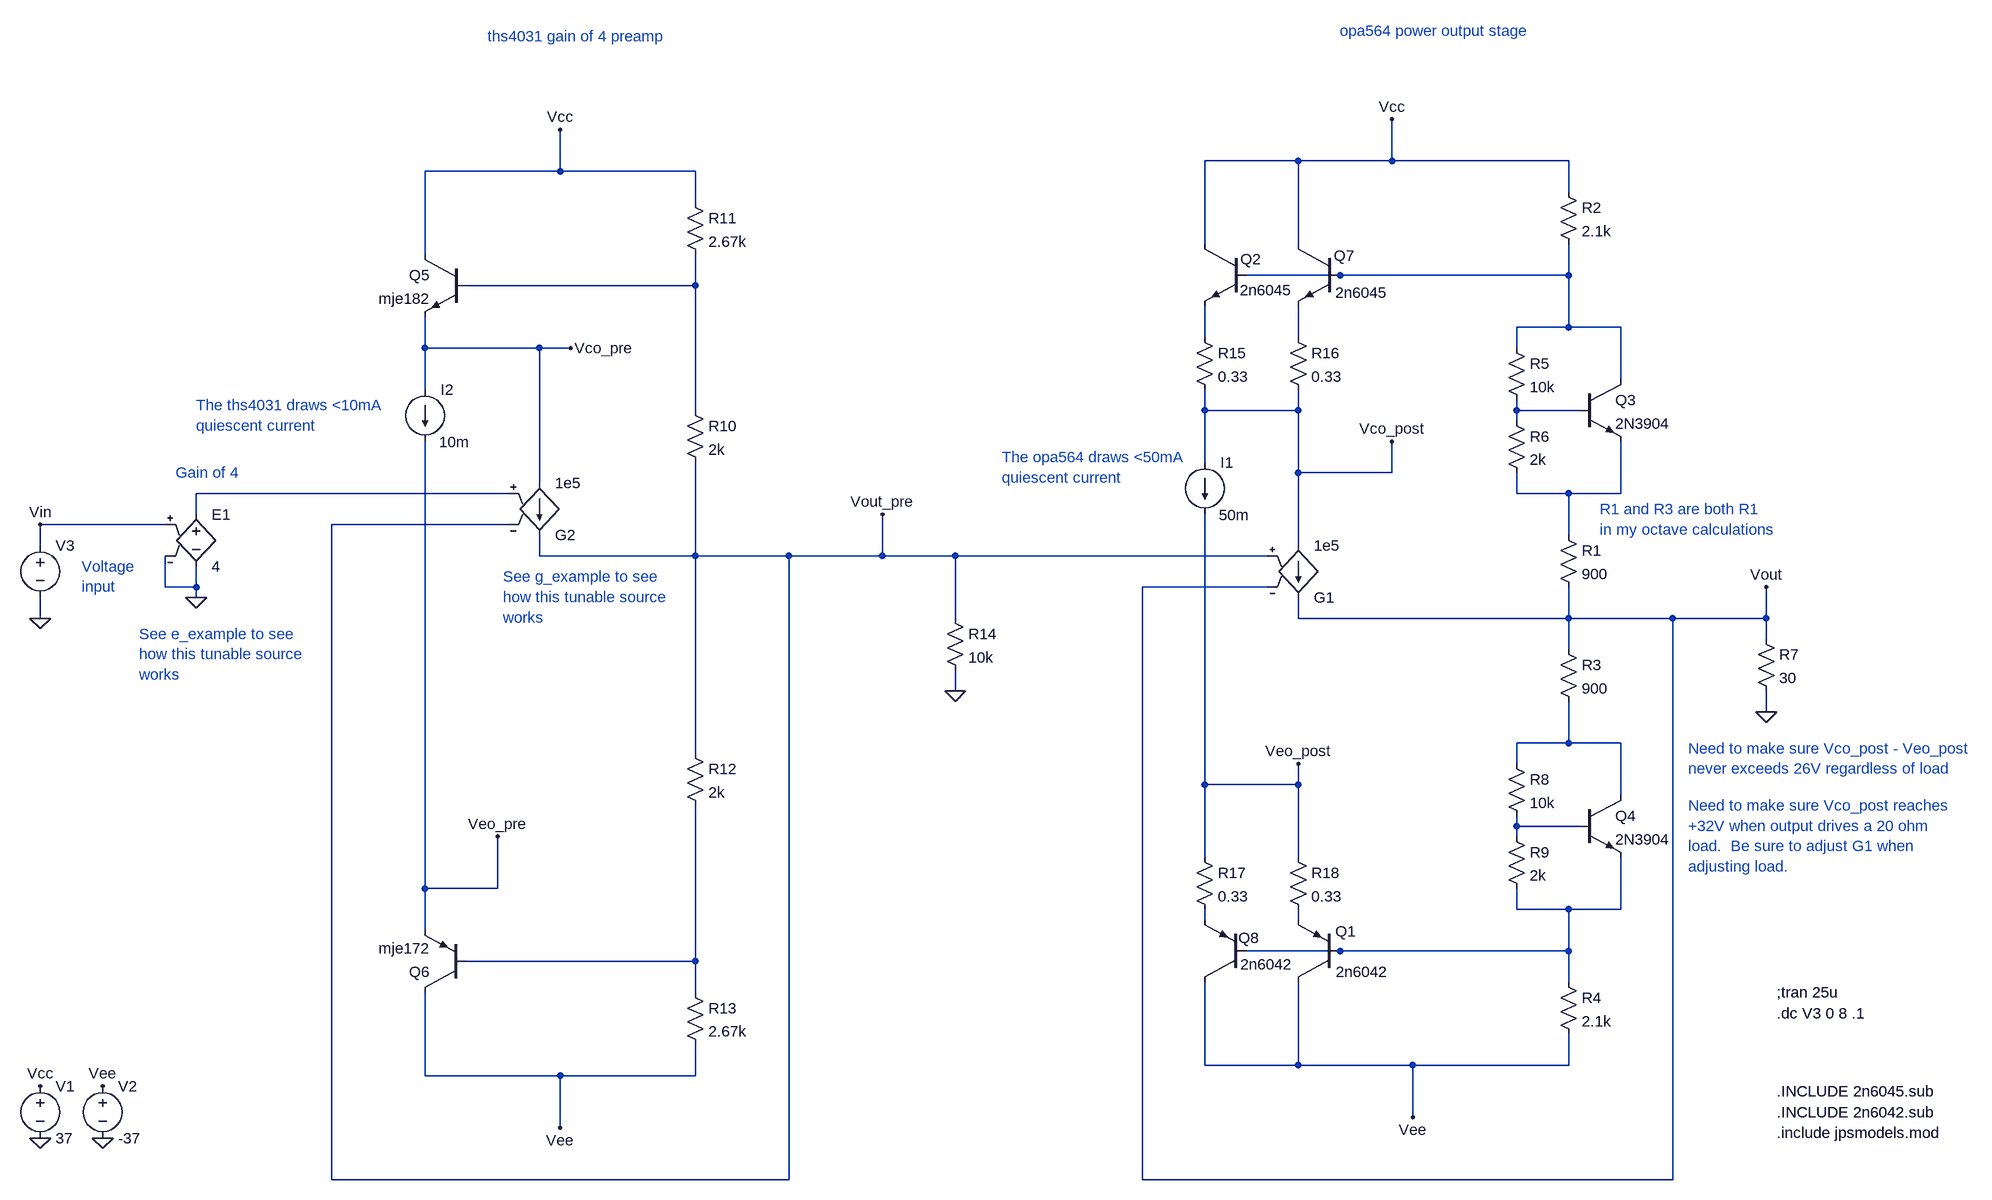
[diagram p0: schematic pa_bootstrap.asc]
pa_bootstrap.asc, the LTspice schematic file:
Version 4
SHEET 1 2440 1112
WIRE 1184 -784 1040 -784
WIRE 1328 -784 1328 -848
WIRE 1328 -784 1184 -784
WIRE 1600 -784 1328 -784
WIRE 48 -768 48 -832
WIRE 48 -768 -160 -768
WIRE 256 -768 48 -768
WIRE 1600 -736 1600 -784
WIRE 256 -720 256 -768
WIRE 1040 -656 1040 -784
WIRE 1184 -656 1184 -784
WIRE -160 -640 -160 -768
WIRE 1248 -608 1104 -608
WIRE 1600 -608 1600 -656
WIRE 1600 -608 1248 -608
WIRE 256 -592 256 -640
WIRE 256 -592 -96 -592
WIRE 1600 -528 1600 -608
WIRE 1600 -528 1520 -528
WIRE 1680 -528 1600 -528
WIRE 1040 -512 1040 -560
WIRE 1184 -512 1184 -560
WIRE -160 -496 -160 -544
WIRE 16 -496 -160 -496
WIRE 64 -496 16 -496
WIRE 1520 -496 1520 -528
WIRE 1680 -448 1680 -528
WIRE -160 -432 -160 -496
WIRE 256 -400 256 -592
WIRE 1040 -400 1040 -432
WIRE 1184 -400 1184 -432
WIRE 1184 -400 1040 -400
WIRE 1520 -400 1520 -416
WIRE 1616 -400 1520 -400
WIRE 1520 -384 1520 -400
WIRE 1040 -320 1040 -400
WIRE 1184 -304 1184 -400
WIRE 1328 -304 1328 -352
WIRE 1328 -304 1184 -304
WIRE 16 -288 16 -496
WIRE -32 -272 -512 -272
WIRE 1520 -272 1520 -304
WIRE 1600 -272 1520 -272
WIRE 1680 -272 1680 -352
WIRE 1680 -272 1600 -272
WIRE -512 -240 -512 -272
WIRE -560 -224 -752 -224
WIRE -32 -224 -304 -224
WIRE 1600 -208 1600 -272
WIRE -752 -192 -752 -224
WIRE 1184 -192 1184 -304
WIRE 16 -176 16 -208
WIRE 256 -176 256 -320
WIRE 256 -176 16 -176
WIRE 400 -176 256 -176
WIRE 544 -176 544 -240
WIRE 544 -176 400 -176
WIRE 656 -176 544 -176
WIRE 1136 -176 656 -176
WIRE -560 -128 -560 -176
WIRE -512 -128 -512 -160
WIRE -512 -128 -560 -128
WIRE 1136 -128 944 -128
WIRE -512 -112 -512 -128
WIRE -752 -80 -752 -112
WIRE 656 -80 656 -176
WIRE 1184 -80 1184 -112
WIRE 1600 -80 1600 -128
WIRE 1600 -80 1184 -80
WIRE 1760 -80 1600 -80
WIRE 1904 -80 1904 -128
WIRE 1904 -80 1760 -80
WIRE 1904 -48 1904 -80
WIRE 1600 -32 1600 -80
WIRE 656 32 656 0
WIRE 1904 64 1904 32
WIRE 1600 112 1600 48
WIRE 1600 112 1520 112
WIRE 1680 112 1600 112
WIRE 256 128 256 -176
WIRE 1520 144 1520 112
WIRE 1040 176 1040 -240
WIRE 1184 176 1184 144
WIRE 1184 176 1040 176
WIRE 1680 192 1680 112
WIRE 1520 240 1520 224
WIRE 1616 240 1520 240
WIRE 1520 256 1520 240
WIRE 1040 288 1040 176
WIRE 1184 288 1184 176
WIRE -160 336 -160 -352
WIRE -48 336 -48 256
WIRE -48 336 -160 336
WIRE 1520 368 1520 336
WIRE 1600 368 1520 368
WIRE 1680 368 1680 288
WIRE 1680 368 1600 368
WIRE 1040 384 1040 368
WIRE 1184 384 1184 368
WIRE -160 400 -160 336
WIRE 1248 432 1104 432
WIRE 1600 432 1600 368
WIRE 1600 432 1248 432
WIRE 256 448 256 208
WIRE 256 448 -96 448
WIRE 1600 480 1600 432
WIRE 256 496 256 448
WIRE 1040 608 1040 480
WIRE 1184 608 1184 480
WIRE 1184 608 1040 608
WIRE 1360 608 1184 608
WIRE 1600 608 1600 560
WIRE 1600 608 1360 608
WIRE -160 624 -160 496
WIRE 48 624 -160 624
WIRE 256 624 256 576
WIRE 256 624 48 624
WIRE 1360 688 1360 608
WIRE 48 704 48 624
WIRE -304 784 -304 -224
WIRE 400 784 400 -176
WIRE 400 784 -304 784
WIRE 944 784 944 -128
WIRE 1760 784 1760 -80
WIRE 1760 784 944 784
FLAG -752 720 0
FLAG -656 720 0
FLAG -752 640 Vcc
FLAG -656 640 Vee
FLAG 1328 -848 Vcc
FLAG 1360 688 Vee
FLAG 1904 -128 Vout
FLAG 1328 -352 Vco_post
FLAG 1184 144 Veo_post
FLAG 1904 64 0
FLAG -752 -80 0
FLAG 48 -832 Vcc
FLAG 48 704 Vee
FLAG 544 -240 Vout_pre
FLAG 64 -496 Vco_pre
FLAG -48 256 Veo_pre
FLAG 656 32 0
FLAG -512 -112 0
FLAG -752 -224 Vin
SYMBOL voltage -752 624 R0
WINDOW 123 0 0 Left 0
WINDOW 39 0 0 Left 0
SYMATTR InstName V1
SYMATTR Value 37
SYMBOL voltage -656 624 R0
WINDOW 123 0 0 Left 0
WINDOW 39 0 0 Left 0
SYMATTR InstName V2
SYMATTR Value -37
SYMBOL res 1584 -224 R0
SYMATTR InstName R1
SYMATTR Value 900
SYMBOL res 1584 -752 R0
SYMATTR InstName R2
SYMATTR Value 2.1k
SYMBOL res 1584 -48 R0
SYMATTR InstName R3
SYMATTR Value 900
SYMBOL res 1584 464 R0
SYMATTR InstName R4
SYMATTR Value 2.1k
SYMBOL res 1888 -64 R0
SYMATTR InstName R7
SYMATTR Value 30
SYMBOL current 1040 -320 R0
WINDOW 3 22 81 Left 0
WINDOW 123 0 0 Left 0
WINDOW 39 0 0 Left 0
SYMATTR Value 50m
SYMATTR InstName I1
SYMBOL res 1504 -512 R0
SYMATTR InstName R5
SYMATTR Value 10k
SYMBOL res 1504 -400 R0
SYMATTR InstName R6
SYMATTR Value 2k
SYMBOL npn 1616 -448 R0
SYMATTR InstName Q3
SYMATTR Value 2N3904
SYMBOL res 1504 128 R0
SYMATTR InstName R8
SYMATTR Value 10k
SYMBOL res 1504 240 R0
SYMATTR InstName R9
SYMATTR Value 2k
SYMBOL npn 1616 192 R0
SYMATTR InstName Q4
SYMATTR Value 2N3904
SYMBOL npn -96 -640 M0
SYMATTR InstName Q5
SYMATTR Value mje182
SYMBOL pnp -96 496 R180
SYMATTR InstName Q6
SYMATTR Value mje172
SYMBOL res 240 -416 R0
SYMATTR InstName R10
SYMATTR Value 2k
SYMBOL res 240 -736 R0
SYMATTR InstName R11
SYMATTR Value 2.67k
SYMBOL res 240 112 R0
SYMATTR InstName R12
SYMATTR Value 2k
SYMBOL res 240 480 R0
SYMATTR InstName R13
SYMATTR Value 2.67k
SYMBOL res 640 -96 R0
SYMATTR InstName R14
SYMATTR Value 10k
SYMBOL e -512 -256 R0
SYMATTR InstName E1
SYMATTR Value 4
SYMBOL voltage -752 -208 R0
WINDOW 123 0 0 Left 0
WINDOW 39 0 0 Left 0
SYMATTR InstName V3
SYMATTR Value ""
SYMBOL npn 1248 -656 M0
WINDOW 0 -23 18 Left 0
WINDOW 3 -74 75 Left 0
SYMATTR InstName Q7
SYMATTR Value 2n6045
SYMATTR Prefix X
SYMBOL pnp 1248 480 R180
WINDOW 0 -25 78 Left 0
WINDOW 3 -75 16 Left 0
SYMATTR InstName Q1
SYMATTR Value 2n6042
SYMATTR Prefix X
SYMBOL res 1024 -528 R0
SYMATTR InstName R15
SYMATTR Value 0.33
SYMBOL res 1168 -528 R0
SYMATTR InstName R16
SYMATTR Value 0.33
SYMBOL res 1024 272 R0
SYMATTR InstName R17
SYMATTR Value 0.33
SYMBOL res 1168 272 R0
SYMATTR InstName R18
SYMATTR Value 0.33
SYMBOL npn 1104 -656 M0
WINDOW 0 -23 23 Left 0
WINDOW 3 -71 71 Left 0
SYMATTR InstName Q2
SYMATTR Value 2n6045
SYMATTR Prefix X
SYMBOL pnp 1104 480 R180
WINDOW 0 -20 68 Left 0
WINDOW 3 -72 27 Left 0
SYMATTR InstName Q8
SYMATTR Value 2n6042
SYMATTR Prefix X
SYMBOL g2 1184 -96 M180
SYMATTR InstName G1
SYMATTR Value 1e5
SYMBOL g2 16 -192 M180
SYMATTR InstName G2
SYMATTR Value 1e5
SYMBOL current -160 -432 R0
WINDOW 3 22 81 Left 0
WINDOW 123 0 0 Left 0
WINDOW 39 0 0 Left 0
SYMATTR Value 10m
SYMATTR InstName I2
TEXT 1920 528 Left 0 !.dc V3 0 8 .1
TEXT 1920 496 Left 0 !;tran 25u
TEXT 1648 -248 Left 0 ;R1 and R3 are both R1\nin my octave calculations
TEXT -688 -160 Left 0 ;Voltage\ninput
TEXT -40 -144 Left 0 ;See g_example to see\nhow this tunable source\nworks
TEXT 1248 -984 Left 0 ;opa564 power output stage
TEXT -64 -976 Left 0 ;ths4031 gain of 4 preamp
TEXT -600 -56 Left 0 ;See e_example to see\nhow this tunable source\nworks
TEXT -544 -304 Left 0 ;Gain of 4
TEXT 1784 120 Left 0 ;Need to make sure Vco_post - Veo_post\nnever exceeds 26V regardless of load
TEXT 728 -328 Left 0 ;The opa564 draws <50mA\nquiescent current
TEXT -512 -408 Left 0 ;The ths4031 draws <10mA\nquiescent current
TEXT 1784 208 Left 0 ;Need to make sure Vco_post reaches\n+32V when output drives a 20 ohm\nload.  Be sure to adjust G1 when \nadjusting load.
TEXT 1920 648 Left 0 !.INCLUDE 2n6045.sub
TEXT 1920 680 Left 0 !.INCLUDE 2n6042.sub
TEXT 1920 712 Left 0 !.include jpsmodels.mod

The netlist it stands for:
* pa_bootstrap.asc
V1 Vcc 0 37
V2 Vee 0 -37
R1 N007 Vout 900
R2 Vcc N001 2.1k
R3 Vout N008 900
R4 N010 Vee 2.1k
R7 Vout 0 30
I1 Vco_post Veo_post 50m
R5 N001 N005 10k
R6 N005 N007 2k
Q3 N001 N005 N007 0 2N3904
R8 N008 N009 10k
R9 N009 N010 2k
Q4 N008 N009 N010 0 2N3904
Q5 Vcc N002 Vco_pre 0 mje182
Q6 Vee N013 Veo_pre 0 mje172
R10 N002 Vout_pre 2k
R11 Vcc N002 2.67k
R12 Vout_pre N013 2k
R13 N013 Vee 2.67k
R14 Vout_pre 0 10k
E1 N006 0 Vin 0 4
V3 Vin 0
XQ7 Vcc N001 N004 2n6045  ; pins C B E
XQ1 Vee N010 N012 2n6042  ; pins C B E
R15 N003 Vco_post 0.33
R16 N004 Vco_post 0.33
R17 Veo_post N011 0.33
R18 Veo_post N012 0.33
XQ2 Vcc N001 N003 2n6045  ; pins C B E
XQ8 Vee N010 N011 2n6042  ; pins C B E
G1 Vco_post Vout Vout_pre Vout 1e5
G2 Vco_pre Vout_pre N006 Vout_pre 1e5
I2 Vco_pre Veo_pre 10m
.model NPN NPN
.model PNP PNP
.lib standard.bjt
.dc V3 0 8 .1
;tran 25u
* R1 and R3 are both R1
* in my octave calculations
* Voltage
* input
* See g_example to see
* how this tunable source
* works
* opa564 power output stage
* ths4031 gain of 4 preamp
* See e_example to see
* how this tunable source
* works
* Gain of 4
* Need to make sure Vco_post - Veo_post
* never exceeds 26V regardless of load
* The opa564 draws <50mA
* quiescent current
* The ths4031 draws <10mA
* quiescent current
* Need to make sure Vco_post reaches
* +32V when output drives a 20 ohm
* load.  Be sure to adjust G1 when
* adjusting load.
.INCLUDE 2n6045.sub
.INCLUDE 2n6042.sub
.include jpsmodels.mod
.backanno
.end

* Results of the author's LTspice run, read from the files saved beside the schematic
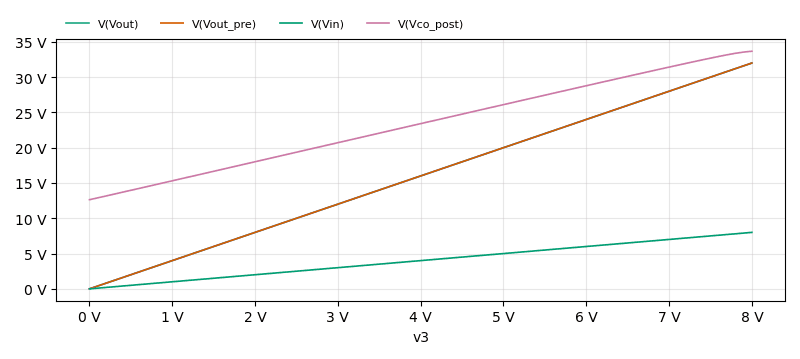
[diagram p1: DC transfer characteristic of pa_bootstrap.asc, plotted from the saved traces]
* DC transfer characteristic, 1 run:
*   V(Vout): -402.4 pV at v3=0 V, 32 V at v3=8 V, min -402.4 pV, max 32 V
*   V(Vout_pre): 198.5 pV at v3=0 V, 32 V at v3=8 V, min 198.5 pV, max 32 V
*   V(Vin): 0 V at v3=0 V, 8 V at v3=8 V, min 0 V, max 8 V
*   V(Vco_post): 12.63 V at v3=0 V, 33.67 V at v3=8 V, min 12.63 V, max 33.67 V